# Altium schematic sheet Sheet1.SchDoc
size B; SheetNumber: 1; SheetTotal: 1
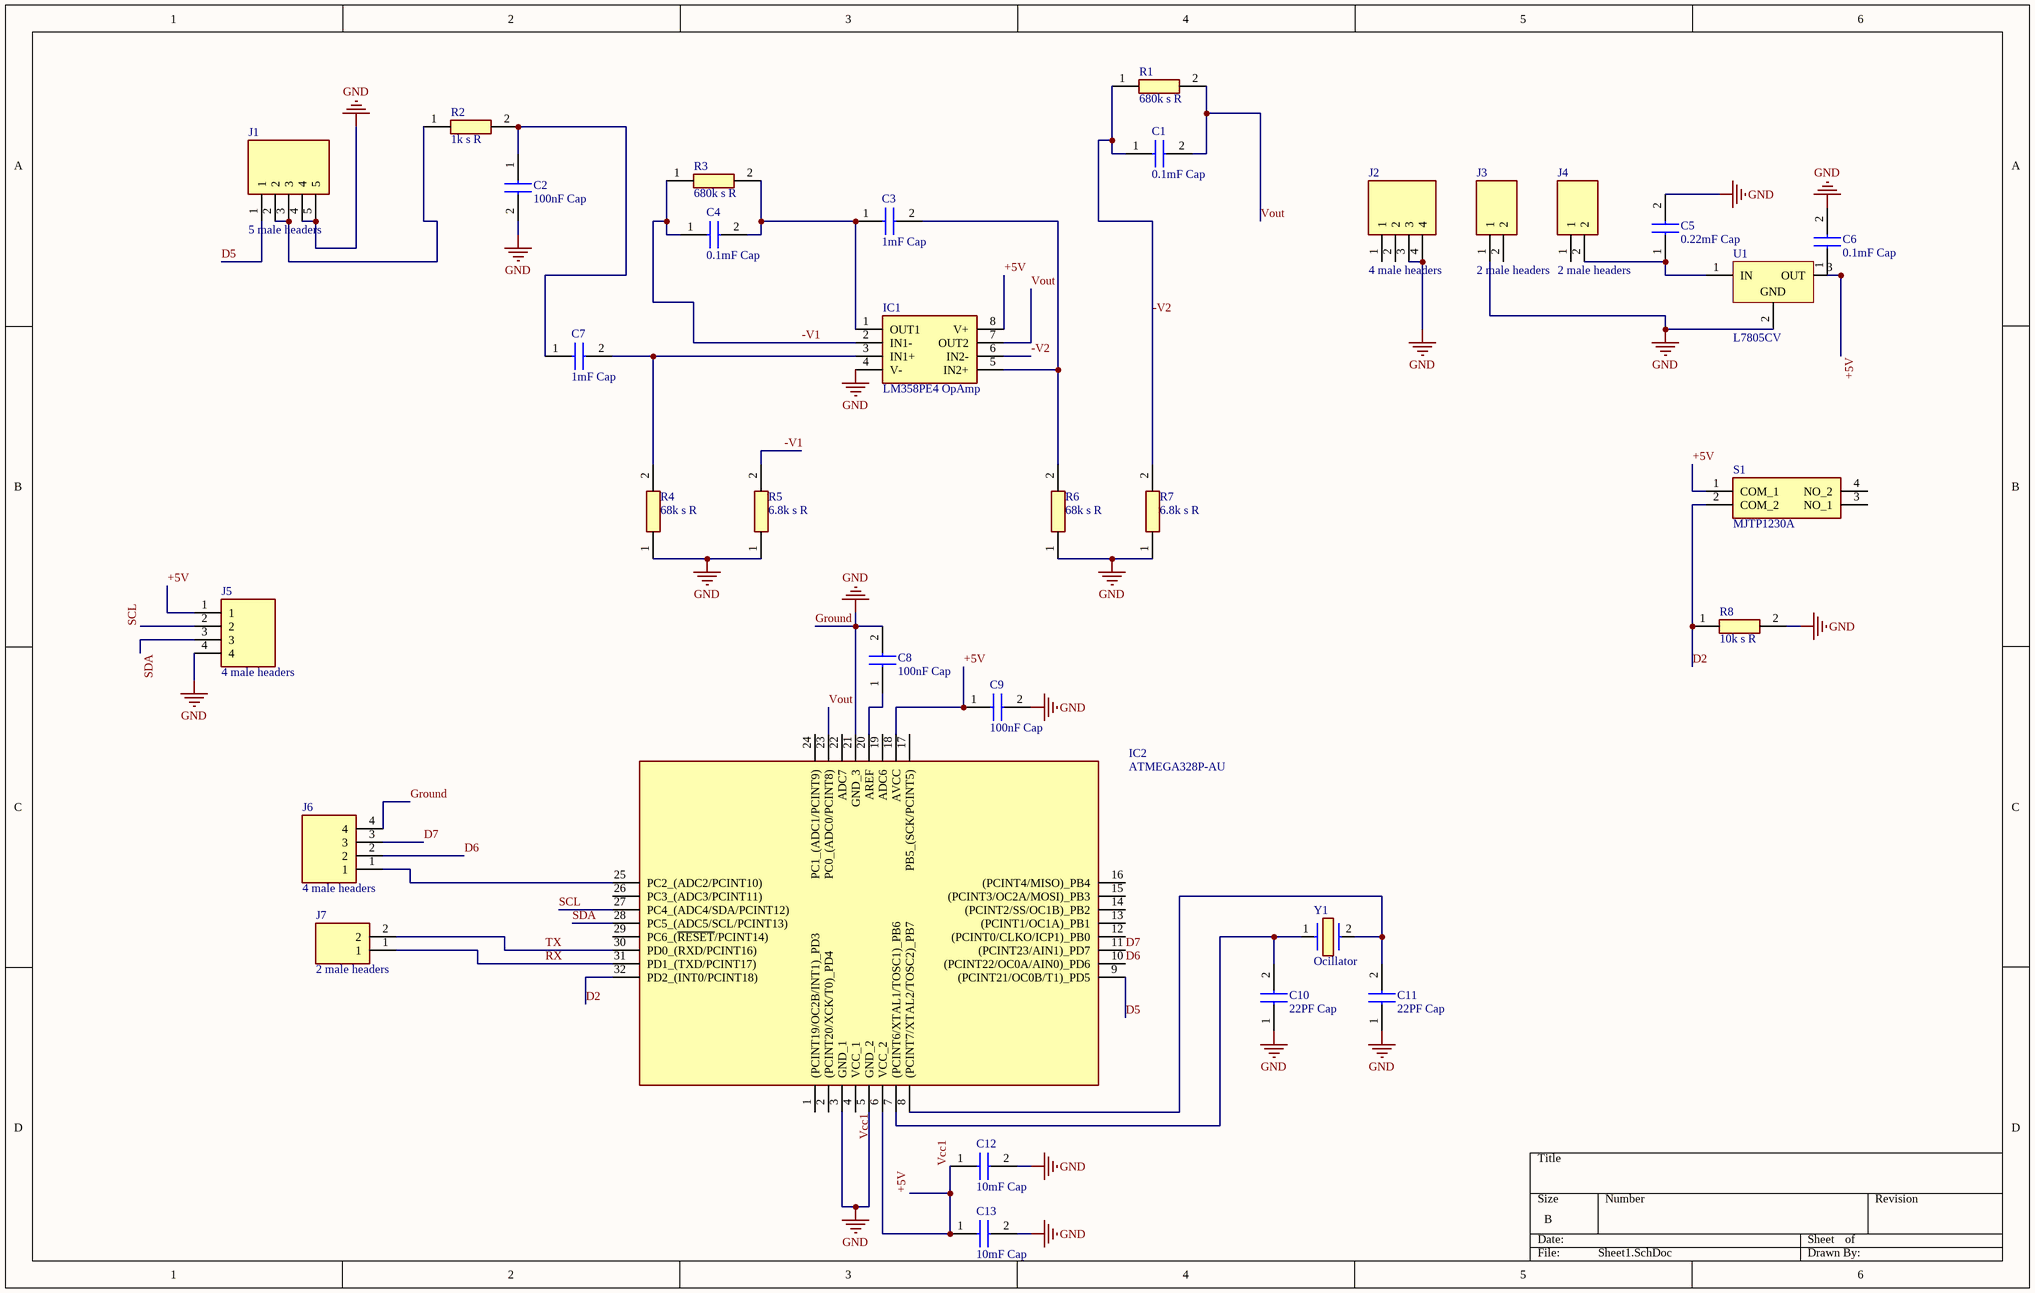
[diagram p0: Sheet1.SchDoc]

## Parts
C1  0.1mF Cap  [VY2332M41Y5US63V7]
C2  100nF Cap  [VY2332M41Y5US63V7]
C3  1mF Cap  [VY2332M41Y5US63V7]
C4  0.1mF Cap  [VY2332M41Y5US63V7]
C5  0.22mF Cap  [VY2332M41Y5US63V7]
C6  0.1mF Cap  [VY2332M41Y5US63V7]
C7  1mF Cap  [VY2332M41Y5US63V7]
C8  100nF Cap  [VY2332M41Y5US63V7]
C9  100nF Cap  [VY2332M41Y5US63V7]
C10  22PF Cap  [VY2332M41Y5US63V7]
C11  22PF Cap  [VY2332M41Y5US63V7]
C12  10mF Cap  [VY2332M41Y5US63V7]
C13  10mF Cap  [VY2332M41Y5US63V7]
IC1  LM358PE4 OpAmp  [DIP794W53P254L959H508Q8N]
IC2  ATMEGA328P-AU  [QFP80P900X900X120-32N]
J1  5 male headers  [HDRV5W63P0X254_1X5_1270X254X970P]
J2  4 male headers  [HDRV4W63P0X254_1X4_1016X250X950P]
J3  2 male headers  [HDRV2W63P0X254_1X2_508X250X970P]
J4  2 male headers  [HDRV2W63P0X254_1X2_508X250X970P]
J5  4 male headers  [HDRV4W63P0X254_1X4_1016X250X950P]
J6  4 male headers  [HDRV4W63P0X254_1X4_1016X250X950P]
J7  2 male headers  [HDRV2W63P0X254_1X2_508X250X970P]
R1  680k s R  [ERJUP6]
R2  1k s R  [ERJUP6]
R3  680k s R  [ERJUP6]
R4  68k s R  [ERJUP6]
R5  6.8k s R  [ERJUP6]
R6  68k s R  [ERJUP6]
R7  6.8k s R  [ERJUP6]
R8  10k s R  [ERJUP6]
S1  MJTP1230A  [MJTP1230A]
U1  L7805CV  [TO220]
Y1  Ocillator  [XT9S20ANA8M]

## Nets
Ground: C2.2 C5.2 C6.2 C8.2 C9.2 C10.1 C11.1 C12.2 C13.2 IC1.4(V-) IC2.3(GND_1) IC2.5(GND_2) IC2.21(GND_3) J1.4 J1.5 J2.3 J2.4 J3.1 J5.4 J6.4 R4.1 R5.1 R6.1 R7.1 R8.2 U1.2(GND)  [also labelled GND]
+5V: C6.1 C9.1 C12.1 C13.1 IC1.8(V+) IC2.4(VCC_1) IC2.6(VCC_2) IC2.18(AVCC) J5.1 S1.1(COM_1) U1.3(OUT)  [also labelled Vcc1]
-V1: C4.1 IC1.2(IN1-) R3.1 R5.2
-V2: C1.1 IC1.6(IN2-) R1.1 R7.2
D2: IC2.32(PD2_(INT0/PCINT18)) R8.1 S1.2(COM_2)
D5: IC2.9((PCINT21/OC0B/T1)_PD5) J1.1
D6: IC2.10((PCINT22/OC0A/AIN0)_PD6) J6.2
D7: IC2.11((PCINT23/AIN1)_PD7) J6.3
RX: IC2.31(PD1_(TXD/PCINT17)) J7.1
SCL: IC2.27(PC4_(ADC4/SDA/PCINT12)) J5.2
SDA: IC2.28(PC5_(ADC5/SCL/PCINT13)) J5.3
TX: IC2.30(PD0_(RXD/PCINT16)) J7.2
Vout: C1.2 IC1.7(OUT2) IC2.23(PC0_(ADC0/PCINT8)) R1.2
NetC2_1: C2.1 C7.1 R2.2
NetC3_1: C3.1 C4.2 IC1.1(OUT1) R3.2
NetC3_2: C3.2 IC1.5(IN2+) R6.2
NetC5_1: C5.1 J4.2 U1.1(IN)
NetC7_2: C7.2 IC1.3(IN1+) R4.2
NetC8_1: C8.1 IC2.20(AREF)
NetC10_2: C10.2 IC2.7((PCINT6/XTAL1/TOSC1)_PB6) Y1.1
NetC11_2: C11.2 IC2.8((PCINT7/XTAL2/TOSC2)_PB7) Y1.2
NetIC2_25: IC2.25(PC2_(ADC2/PCINT10)) J6.1
NetJ1_2: J1.2 J1.3 R2.1

Not connected (* = marked no-connect by the designer): IC2 1((PCINT19/OC2B/INT1)_PD3) 2((PCINT20/XCK/T0)_PD4) 12((PCINT0/CLKO/ICP1)_PB0) 13((PCINT1/OC1A)_PB1) 14((PCINT2/SS/OC1B)_PB2) 15((PCINT3/OC2A/MOSI)_PB3) 16((PCINT4/MISO)_PB4) 17(PB5_(SCK/PCINT5)) 19(ADC6) 22(ADC7) 24(PC1_(ADC1/PCINT9)) 26(PC3_(ADC3/PCINT11)) 29(PC6_(~{RESET}/PCINT14)); J2 1 2; J3 2; J4 1; S1 3(NO_1) 4(NO_2)

## Library data of the parts
C1 C4 C6 = 0.1mF Cap: Capacitor; Manufacturer_Name: Vishay; Datasheet Link: https://datasheet.datasheetarchive.com/originals/dk/DKDS-39/9814.pdf; Height: 13.5mm; Manufacturer_Part_Number: VY2332M41Y5US63V7; Mouser Part Number: 72-VY2332M41Y5US63V7; Mouser Price/Stock: https://www.mouser.co.uk/ProductDetail/Vishay-BC-Components/VY2332M41Y5US63V7?qs=YhDfSRCt1jTfstvwiD5kGA%3D%3D
C2 C8 C9 = 100nF Cap: Capacitor; Manufacturer_Name: Vishay; Datasheet Link: https://datasheet.datasheetarchive.com/originals/dk/DKDS-39/9814.pdf; Height: 13.5mm; Manufacturer_Part_Number: VY2332M41Y5US63V7; Mouser Part Number: 72-VY2332M41Y5US63V7; Mouser Price/Stock: https://www.mouser.co.uk/ProductDetail/Vishay-BC-Components/VY2332M41Y5US63V7?qs=YhDfSRCt1jTfstvwiD5kGA%3D%3D
C3 C7 = 1mF Cap: Capacitor; Manufacturer_Name: Vishay; Datasheet Link: https://datasheet.datasheetarchive.com/originals/dk/DKDS-39/9814.pdf; Height: 13.5mm; Manufacturer_Part_Number: VY2332M41Y5US63V7; Mouser Part Number: 72-VY2332M41Y5US63V7; Mouser Price/Stock: https://www.mouser.co.uk/ProductDetail/Vishay-BC-Components/VY2332M41Y5US63V7?qs=YhDfSRCt1jTfstvwiD5kGA%3D%3D
C5 = 0.22mF Cap: Capacitor; Manufacturer_Name: Vishay; Datasheet Link: https://datasheet.datasheetarchive.com/originals/dk/DKDS-39/9814.pdf; Height: 13.5mm; Manufacturer_Part_Number: VY2332M41Y5US63V7; Mouser Part Number: 72-VY2332M41Y5US63V7; Mouser Price/Stock: https://www.mouser.co.uk/ProductDetail/Vishay-BC-Components/VY2332M41Y5US63V7?qs=YhDfSRCt1jTfstvwiD5kGA%3D%3D
C10 C11 = 22PF Cap: Capacitor; Manufacturer_Name: Vishay; Datasheet Link: https://datasheet.datasheetarchive.com/originals/dk/DKDS-39/9814.pdf; Height: 13.5mm; Manufacturer_Part_Number: VY2332M41Y5US63V7; Mouser Part Number: 72-VY2332M41Y5US63V7; Mouser Price/Stock: https://www.mouser.co.uk/ProductDetail/Vishay-BC-Components/VY2332M41Y5US63V7?qs=YhDfSRCt1jTfstvwiD5kGA%3D%3D
C12 C13 = 10mF Cap: Capacitor; Manufacturer_Name: Vishay; Datasheet Link: https://datasheet.datasheetarchive.com/originals/dk/DKDS-39/9814.pdf; Height: 13.5mm; Manufacturer_Part_Number: VY2332M41Y5US63V7; Mouser Part Number: 72-VY2332M41Y5US63V7; Mouser Price/Stock: https://www.mouser.co.uk/ProductDetail/Vishay-BC-Components/VY2332M41Y5US63V7?qs=YhDfSRCt1jTfstvwiD5kGA%3D%3D
IC1 = LM358PE4 OpAmp: Integrated Circuit; Manufacturer_Name: Texas Instruments; Datasheet Link: http://www.ti.com/lit/ds/symlink/lm358.pdf; Height: 5.08mm; Manufacturer_Part_Number: LM358PE4; Mouser Part Number: 595-LM358PE4; Mouser Price/Stock: https://www.mouser.co.uk/ProductDetail/Texas-Instruments/LM358PE4?qs=VBduBm9rCJTWtuRHSrRjAg%3D%3D; Arrow Part Number: LM358PE4; Arrow Price/Stock: https://www.arrow.com/en/products/lm358pe4/texas-instruments?region=nac
IC2 = ATMEGA328P-AU: Integrated Circuit; Manufacturer_Name: Microchip; Datasheet Link: https://componentsearchengine.com/Datasheets/2/ATMEGA328P-AU.pdf; Height: 1.2mm; Manufacturer_Part_Number: ATMEGA328P-AU; Mouser Part Number: 556-ATMEGA328P-AU; Mouser Price/Stock: https://www.mouser.co.uk/ProductDetail/Microchip-Technology/ATMEGA328P-AU?qs=K8BHR703ZXiCmmgp6%2FGNmQ%3D%3D; Arrow Part Number: ATMEGA328P-AU; Arrow Price/Stock: https://www.arrow.com/en/products/atmega328p-au/microchip-technology?region=europe
J1 = 5 male headers: Connector; Manufacturer_Name: TE Connectivity; Manufacturer_Part_Number: 825433-5; Datasheet Link: https://www.te.com/commerce/DocumentDelivery/DDEController?Action=srchrtrv&DocNm=825433&DocType=Customer+Drawing&DocLang=English&DocFormat=pdf&PartCntxt=825433-5; Height: 9.7mm; Mouser Part Number: 571-825433-5; Mouser Price/Stock: https://www.mouser.co.uk/ProductDetail/TE-Connectivity/825433-5?qs=Yxch5oR%2FTsPo6cKMIYPWXA%3D%3D; Arrow Part Number: 825433-5; Arrow Price/Stock: https://www.arrow.com/en/products/825433-5/te-connectivity?region=europe
J2 J5 J6 = 4 male headers: Connector; Manufacturer_Name: TE Connectivity; Manufacturer_Part_Number: 826629-4; Datasheet Link: https://componentsearchengine.com/Datasheets/2/826629-4.pdf; Height: 9.5mm; Mouser Part Number: 571-826629-4; Mouser Price/Stock: https://www.mouser.co.uk/ProductDetail/TE-Connectivity/826629-4?qs=FazuUmncXom81cYQ0o6zwQ%3D%3D; Arrow Part Number: 826629-4; Arrow Price/Stock: https://www.arrow.com/en/products/826629-4/te-connectivity?region=europe
J3 J4 J7 = 2 male headers: Connector; Manufacturer_Name: TE Connectivity; Manufacturer_Part_Number: 826926-2; Datasheet Link: http://www.te.com/commerce/DocumentDelivery/DDEController?Action=showdoc&DocId=Customer+Drawing%7F826629%7FAB%7Fpdf%7FEnglish%7FENG_CD_826629_AB.pdf%7F826926-2; Height: 9.7mm; Mouser Part Number: 571-826926-2; Mouser Price/Stock: https://www.mouser.co.uk/ProductDetail/TE-Connectivity/826926-2?qs=wMzmFFBcbXSakt8A2XXzBg%3D%3D; Arrow Part Number: 826926-2; Arrow Price/Stock: https://www.arrow.com/en/products/826926-2/te-connectivity?region=europe
R1 R3 = 680k s R: Resistor; Manufacturer_Name: Panasonic; Manufacturer_Part_Number: ERJ-UP6F5760V; Datasheet Link: https://industrial.panasonic.com/cdbs/www-data/pdf/RDP0000/AOA0000C337.pdf; Height: 0.7mm; Mouser Part Number: 667-ERJ-UP6F5760V; Mouser Price/Stock: https://www.mouser.co.uk/ProductDetail/Panasonic/ERJ-UP6F5760V?qs=dbcCsuKDzFWkTsFWGgr5lA%3D%3D
R2 = 1k s R: Resistor; Manufacturer_Name: Panasonic; Manufacturer_Part_Number: ERJ-UP6F5760V; Datasheet Link: https://industrial.panasonic.com/cdbs/www-data/pdf/RDP0000/AOA0000C337.pdf; Height: 0.7mm; Mouser Part Number: 667-ERJ-UP6F5760V; Mouser Price/Stock: https://www.mouser.co.uk/ProductDetail/Panasonic/ERJ-UP6F5760V?qs=dbcCsuKDzFWkTsFWGgr5lA%3D%3D
R4 R6 = 68k s R: Resistor; Manufacturer_Name: Panasonic; Manufacturer_Part_Number: ERJ-UP6F5760V; Datasheet Link: https://industrial.panasonic.com/cdbs/www-data/pdf/RDP0000/AOA0000C337.pdf; Height: 0.7mm; Mouser Part Number: 667-ERJ-UP6F5760V; Mouser Price/Stock: https://www.mouser.co.uk/ProductDetail/Panasonic/ERJ-UP6F5760V?qs=dbcCsuKDzFWkTsFWGgr5lA%3D%3D
R5 R7 = 6.8k s R: Resistor; Manufacturer_Name: Panasonic; Manufacturer_Part_Number: ERJ-UP6F5760V; Datasheet Link: https://industrial.panasonic.com/cdbs/www-data/pdf/RDP0000/AOA0000C337.pdf; Height: 0.7mm; Mouser Part Number: 667-ERJ-UP6F5760V; Mouser Price/Stock: https://www.mouser.co.uk/ProductDetail/Panasonic/ERJ-UP6F5760V?qs=dbcCsuKDzFWkTsFWGgr5lA%3D%3D
R8 = 10k s R: Resistor; Manufacturer_Name: Panasonic; Manufacturer_Part_Number: ERJ-UP6F5760V; Datasheet Link: https://industrial.panasonic.com/cdbs/www-data/pdf/RDP0000/AOA0000C337.pdf; Height: 0.7mm; Mouser Part Number: 667-ERJ-UP6F5760V; Mouser Price/Stock: https://www.mouser.co.uk/ProductDetail/Panasonic/ERJ-UP6F5760V?qs=dbcCsuKDzFWkTsFWGgr5lA%3D%3D
S1 = MJTP1230A: Switch; Manufacturer_Name: Apem; Datasheet Link: https://componentsearchengine.com/Datasheets/2/MJTP1230A.pdf; Height: 5mm; Manufacturer_Part_Number: MJTP1230A; Mouser Part Number: 642-MJTP1230A; Mouser Price/Stock: https://www.mouser.co.uk/ProductDetail/Apem/MJTP1230A?qs=Uv2m1HzDAyrCq22V7auhWA%3D%3D
U1 = CMP-0244-00483-1: Positive Voltage Regulator, 5V, 3-Pin TO-220; PackageDescription: TO, Thru-Hole, Vertical, Heatsink Mounted; 3 In-Line Leads; Pitch 2.54 mm; ComponentLink2Description: Datasheet; PackageReference: TO220; ComponentLink3URL: http://www.st.com/internet/com/TECHNICAL_RESOURCES/TECHNICAL_LITERATURE/PACKAGE_INFORMATION/CD00004649.pdf; DatasheetVersion: 16/11/2011; ComponentLink1Description: Manufacturer URL; ComponentLink1URL: http://www.st.com; PackageVersion: ver3.0; ComponentLink3Description: Package Specification; ComponentLink2URL: http://www.st.com/internet/com/TECHNICAL_RESOURCES/TECHNICAL_LITERATURE/DATASHEET/CD00000444.pdf
Y1 = Ocillator: Crystal or Oscillator; Manufacturer_Name: Vishay; Datasheet Link: https://www.vishay.com/docs/35014/xt49s.pdf; Height: 3.5mm; Manufacturer_Part_Number: XT9S20ANA8M; Mouser Part Number: 73-XT49S800-20; Mouser Price/Stock: https://www.mouser.co.uk/ProductDetail/Vishay-Dale/XT9S20ANA8M?qs=oFi4%2FQsgZXYxL7wCZW5FzA%3D%3D; Arrow Part Number: XT9S20ANA8M; Arrow Price/Stock: https://www.arrow.com/en/products/xt9s20ana8m/vishay?region=nac